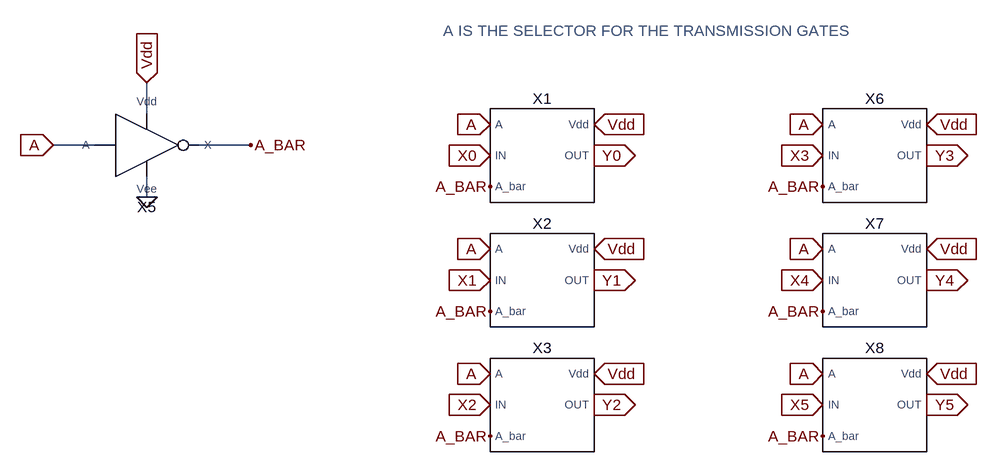
[diagram p0: schematic 6X6TG.asc]
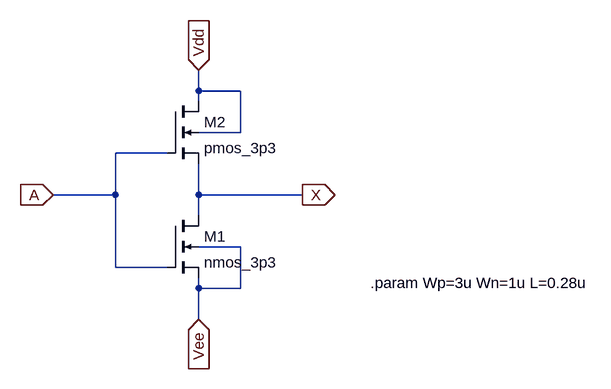
[diagram p1: sub-circuit invx1.asc]
6X6TG.asc, the LTspice schematic file:
Version 4
SHEET 1 880 684
WIRE -448 -64 -448 -112
WIRE -528 -16 -592 -16
WIRE -288 -16 -368 -16
WIRE -448 64 -448 32
FLAG 240 -48 Vdd
IOPIN 240 -48 In
FLAG 240 0 Y0
IOPIN 240 0 Out
FLAG 80 0 X0
IOPIN 80 0 In
FLAG 80 -48 A
IOPIN 80 -48 In
FLAG -592 -16 A
IOPIN -592 -16 In
FLAG -288 -16 A_BAR
FLAG 80 48 A_BAR
FLAG 240 144 Vdd
IOPIN 240 144 In
FLAG 240 192 Y1
IOPIN 240 192 Out
FLAG 80 192 X1
IOPIN 80 192 In
FLAG 80 144 A
IOPIN 80 144 In
FLAG 80 240 A_BAR
FLAG 240 336 Vdd
IOPIN 240 336 In
FLAG 240 384 Y2
IOPIN 240 384 Out
FLAG 80 384 X2
IOPIN 80 384 In
FLAG 80 336 A
IOPIN 80 336 In
FLAG 80 432 A_BAR
FLAG -448 64 0
FLAG -448 -112 Vdd
IOPIN -448 -112 In
FLAG 752 -48 Vdd
IOPIN 752 -48 In
FLAG 752 0 Y3
IOPIN 752 0 Out
FLAG 592 0 X3
IOPIN 592 0 In
FLAG 592 -48 A
IOPIN 592 -48 In
FLAG 592 48 A_BAR
FLAG 752 144 Vdd
IOPIN 752 144 In
FLAG 752 192 Y4
IOPIN 752 192 Out
FLAG 592 192 X4
IOPIN 592 192 In
FLAG 592 144 A
IOPIN 592 144 In
FLAG 592 240 A_BAR
FLAG 752 336 Vdd
IOPIN 752 336 In
FLAG 752 384 Y5
IOPIN 752 384 Out
FLAG 592 384 X5
IOPIN 592 384 In
FLAG 592 336 A
IOPIN 592 336 In
FLAG 592 432 A_BAR
SYMBOL TGATE 160 0 R0
SYMATTR InstName X1
SYMBOL INVx1 -448 -16 R0
SYMATTR InstName X5
SYMBOL TGATE 160 192 R0
SYMATTR InstName X2
SYMBOL TGATE 160 384 R0
SYMATTR InstName X3
SYMBOL TGATE 672 0 R0
SYMATTR InstName X6
SYMBOL TGATE 672 192 R0
SYMATTR InstName X7
SYMBOL TGATE 672 384 R0
SYMATTR InstName X8
TEXT 8 -192 Left 2 ;A IS THE SELECTOR FOR THE TRANSMISSION GATES

invx1.asc, the sub-circuit schematic file:
Version 4
SHEET 1 2776 836
WIRE 416 -16 416 -48
WIRE 480 -16 416 -16
WIRE 416 0 416 -16
WIRE 480 48 480 -16
WIRE 480 48 416 48
WIRE 368 80 288 80
WIRE 288 144 288 80
WIRE 288 144 192 144
WIRE 416 144 416 96
WIRE 576 144 416 144
WIRE 416 176 416 144
WIRE 480 224 416 224
WIRE 288 256 288 144
WIRE 368 256 288 256
WIRE 416 288 416 272
WIRE 480 288 480 224
WIRE 480 288 416 288
WIRE 416 336 416 288
FLAG 416 -48 Vdd
IOPIN 416 -48 In
FLAG 192 144 A
IOPIN 192 144 In
FLAG 576 144 X
IOPIN 576 144 Out
FLAG 416 336 Vee
IOPIN 416 336 In
SYMBOL nmos4 368 176 R0
SYMATTR InstName M1
SYMATTR Value nmos_3p3
SYMATTR Value2 l={L} w={Wn}
SYMBOL nmos4 368 0 R0
SYMATTR InstName M2
SYMATTR Value pmos_3p3
SYMATTR Value2 l={L} w={Wp}
TEXT 680 280 Left 2 !.param Wp=3u Wn=1u L=0.28u

The netlist it stands for:
* 6X6TG.asc
XX1 A A_BAR X0 Vdd Y0 TGATE L=0.28u Wn=1u Wp=3u M=1  ; pins A A_bar IN Vdd OUT
XX5 A Vdd A_BAR 0 invx1
XX2 A A_BAR X1 Vdd Y1 TGATE L=0.28u Wn=1u Wp=3u M=1  ; pins A A_bar IN Vdd OUT
XX3 A A_BAR X2 Vdd Y2 TGATE L=0.28u Wn=1u Wp=3u M=1  ; pins A A_bar IN Vdd OUT
XX6 A A_BAR X3 Vdd Y3 TGATE L=0.28u Wn=1u Wp=3u M=1  ; pins A A_bar IN Vdd OUT
XX7 A A_BAR X4 Vdd Y4 TGATE L=0.28u Wn=1u Wp=3u M=1  ; pins A A_bar IN Vdd OUT
XX8 A A_BAR X5 Vdd Y5 TGATE L=0.28u Wn=1u Wp=3u M=1  ; pins A A_bar IN Vdd OUT

* block symbol definitions
.subckt invx1 A Vdd X Vee
M1 X A Vee Vee nmos_3p3 l={L} w={Wn}
M2 Vdd A X Vdd pmos_3p3 l={L} w={Wp}
.param Wp=3u Wn=1u L=0.28u
.ends invx1

.model NMOS NMOS
.model PMOS PMOS
.lib standard.mos
* A IS THE SELECTOR FOR THE TRANSMISSION GATES
.backanno
.end